# EAGLE design Plato_soldadura_328P (EAGLE 6.5.0)
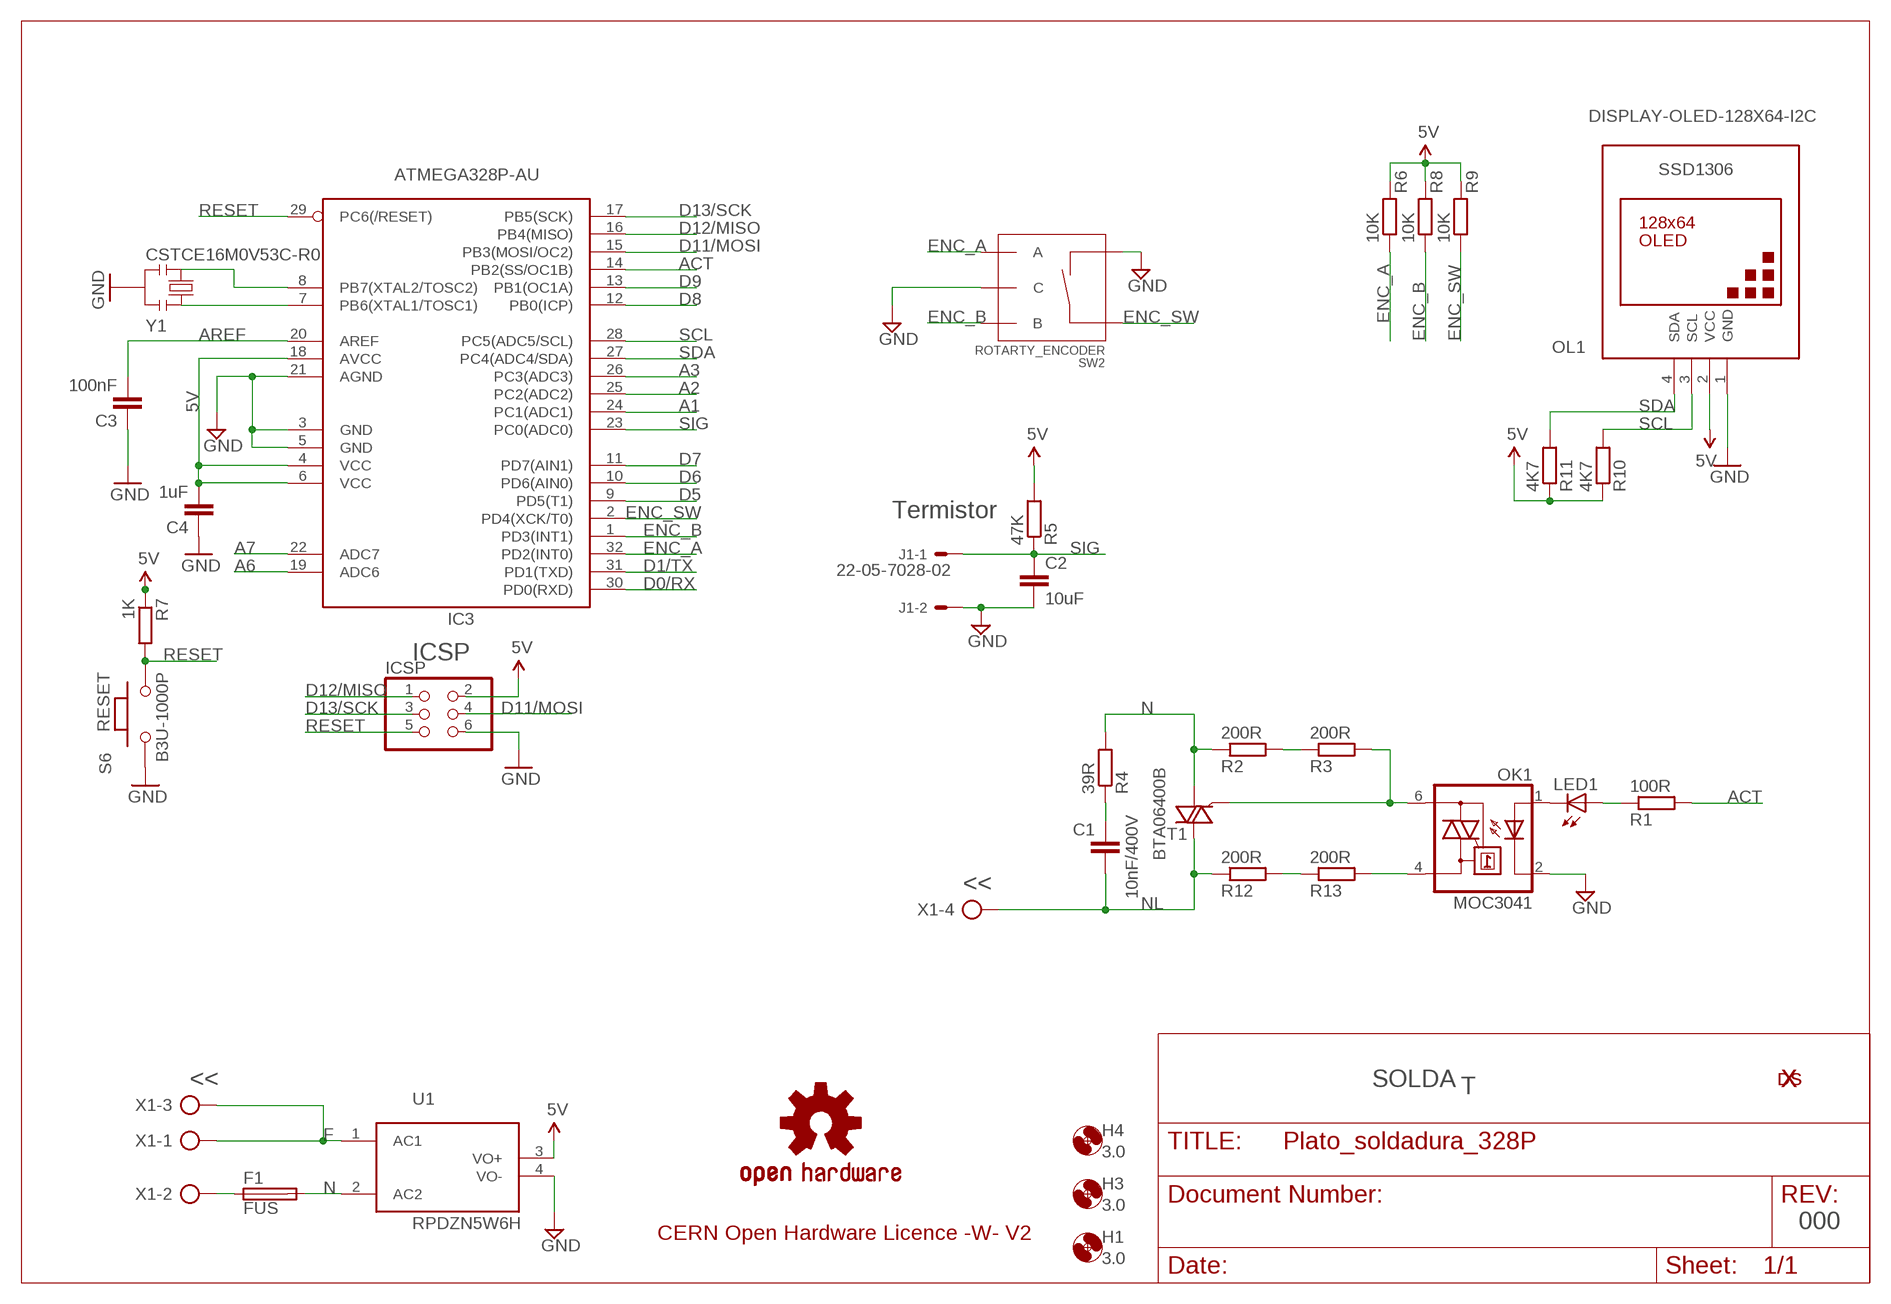
[diagram p0: schematic, sheet 1]

## Parts
C1  10nF/400V  C-EU075-042X103  [C075-042X103]
C2  10uF  C-EUC1206  [C1206]
C3  100nF  C-EUC0603  [C0603]
C4  1uF  C-EUC0603  [C0603]
F1  FUS  FUSETE5  [TE5]
H1  3.0  MOUNT-HOLE3.0  [3,0]
H3  3.0  MOUNT-HOLE3.0  [3,0]
H4  3.0  MOUNT-HOLE3.0  [3,0]
IC3  ATMEGA328P-AU  0265_ATMEGA328P-AU  [TQFP32-08]
ICSP  0114_PH254-203DF118A00V  [2X03]
J1  22-05-7028-02  [7395-02]
LED1  LEDCHIP-LED0603  [CHIP-LED0603]
LOGO2  OSHW-LOGOL  [ESCORNA_LBRESCORNA_CPU_2_10_SPARKFUN-AESTHETICS_OSHW-LOGO-L]
OK1  MOC3041  IL410  [DIL06]
OL1  DISPLAY-OLED-128X64-I2C  [DISPLAY-OLED-128X64-I2C]
R1  100R  R-EU_R0603  [R0603]
R2  200R  R-EU_R1206  [R1206]
R3  200R  R-EU_R1206  [R1206]
R4  39R  R-EU_0204/7  [0204/7]
R5  47K  R-EU_R0603  [R0603]
R6  10K  R-EU_R0603  [R0603]
R7  1K  R-EU_R0603  [R0603]
R8  10K  R-EU_R0603  [R0603]
R9  10K  R-EU_R0603  [R0603]
R10  4K7  R-EU_R0603  [R0603]
R11  4K7  R-EU_R0603  [R0603]
R12  200R  R-EU_R1206  [R1206]
R13  200R  R-EU_R1206  [R1206]
S6  B3U-1000P  0173_IT-1185AP1C-160G-G_T&R  [SMD_157SW]
SW2  ROTARTY_ENCODER  [ROTARY_ENC_PLAIN]
T1  BTA06400B  BT136  [TO220AB]
U1  RPDZN5W6H  [RPDZN5W6H]
U$7  XDESIG_XDESIG5MM  [XDESIG_XDESIG_CU]
U$8  XDESIG_XDESIG21  [XDESIG_XDESIG]
X1  AK500/4-H  [AK500/4-H]
Y1  CSTCE16M0V53C-R0  0011_CSTCE16M0V53-R0  [RESONATOR]

## Nets
5V: C4.2 IC3.4(VCC) IC3.6(VCC) IC3.18(AVCC) ICSP.2 OL1.2(VCC) R5.2 R6.2 R7.1 R8.2 R9.2 R10.1 R11.1 U1.3(VO+)
A1: IC3.24(PC1(ADC1))
A2: IC3.25(PC2(ADC2))
A3: IC3.26(PC3(ADC3))
A6: IC3.19(ADC6)
A7: IC3.22(ADC7)
ACT: IC3.14(PB2(SS/OC1B)) R1.2
AREF [aref]: C3.2 IC3.20(AREF)
D0/RX: IC3.30(PD0(RXD))
D1/TX: IC3.31(PD1(TXD))
D5: IC3.9(PD5(T1))
D6: IC3.10(PD6(AIN0))
D7: IC3.11(PD7(AIN1))
D8: IC3.12(PB0(ICP))
D9: IC3.13(PB1(OC1A))
D11/MOSI: IC3.15(PB3(MOSI/OC2)) ICSP.4
D12/MISO: IC3.16(PB4(MISO)) ICSP.1
D13/SCK: IC3.17(PB5(SCK)) ICSP.3
ENC_A: IC3.32(PD2(INT0)) R6.1 SW2.A
ENC_B: IC3.1(PD3(INT1)) R8.1 SW2.B
ENC_SW: IC3.2(PD4(XCK/T0)) R9.1 SW2.SW+
F: U1.1(AC1) X1.1 X1.3
GND: C2.2 C3.1 C4.1 IC3.3(GND) IC3.5(GND) IC3.21(AGND) ICSP.6 J1.2 OK1.2(C) OL1.1(GND) S6.1 SW2.C SW2.SW- U1.4(VO-) Y1.2
N: F1.2 R2.1 R4.2 T1.1(A1) U1.2(AC2)
N$1: OK1.4(A1) R13.2
N$2: F1.1 X1.2
N$3: OK1.6(A2) R3.2 T1.3(G)
N$4: LED1.C OK1.1(A)
N$5: LED1.A R1.1
N$6: R2.2 R3.1
N$7: R12.2 R13.1
N$11: C1.1 R4.1
N$17: IC3.7(PB6(XTAL1/TOSC1)) Y1.1
N$18: IC3.8(PB7(XTAL2/TOSC2)) Y1.3
NL: C1.2 R12.1 T1.2(A2) X1.4
RESET: IC3.29(PC6(/RESET)) ICSP.5 R7.2 S6.2
SCL: IC3.28(PC5(ADC5/SCL)) OL1.3(SCL) R10.2
SDA: IC3.27(PC4(ADC4/SDA)) OL1.4(SDA) R11.2
SIG: C2.1 IC3.23(PC0(ADC0)) J1.1 R5.1

## Notes on the sheet
- SSD1306
- Termistor
- ICSP
- RESET
- <<
- << | SOLDA
- T
- 000
- CERN Open Hardware Licence -W- V2

## Library data of the parts
C1-C4 = rcl:C-EU: CAPACITOR, European symbol
F1 = fuse:FUSE: Fuse; OC_FARNELL: unknown; OC_NEWARK: unknown
H1 H3 H4 = holes:MOUNT-HOLE: MOUNTING HOLE with drill center marker
IC3 = IntegratedCircuits:0265_ATMEGA328P-AU: 8-bit Microcontroller with 32KBytes In-System Programmable Flash ATMEGA328P-AU; CASE: TQFP32_7x7; MONTHLY_USAGE: _____; PART_NUMBER: ATMEGA328P-AU; PRICE: _____; SUPPLIER: _____; TYPE: Circuito_Integrato
ICSP = Connettori:0114_PH254-203DF118A00V: 3x2 M V h 8,5 mm p2,54; MONTHLY_USAGE: _____; PART_NUMBER: PH254-203DF118A00V; PRICE: _____; SUPPLIER: _____; TYPE: Connettori; VALUE: ICSP
J1 = con-molex:22-?-02: CONNECTOR wire to board 2.54 mm (.1 inch) pitch header; OC_FARNELL: 9731601; OC_NEWARK: unknown
LED1 = led:LED: LED OSRAM: - CHIPLED LG R971, LG N971, LY N971, LG Q971, LY Q971, LO R971, LY R971 LH N974, LH R974 LS Q976, LO Q976, LY Q976 LO Q996 - Hyper CHIPLED LW Q18S LB Q993, LB Q99A, LB R99A - SideLED LS A670, LO A670, LY A670, LG A670, LP A670 LB A673, LV A673, LT A673, LW A673 LH A674 LY A675 LS A676, LA A676, LO A676, LY A676, LW A676 LS A679, LY A679, LG A679 - Hyper Micro SIDELED® LS Y876, LA Y876, LO Y876, LY Y876 LT Y87S - SmartLED LW L88C, LW L88S LB L89C, LB L89S, LG L890 LS L89K, LO L89K, LY L89K LS L896, LA L896, LO L896, LY L896 - TOPLED LS T670, LO T670, LY T670, LG T670, LP T670 LSG T670, LSP T670, LSY T670, LOP T670, LYG T670 LG T671, LOG T671, LSG T671 LB T673, LV T673, LT T673, LW T673 LH T674 LS T676, LA T676, LO T676, LY T676, LB T676, LH T676, LSB T676, LW T676 LB T67C, LV T67C, LT T67C, LS T67K, LO T67K, LY T67K, LW E67C LS E67B, LA E67B, LO E67B, LY E67B, LB E67C, LV E67C, LT E67C LW T67C LS T679, LY T679, LG T679 LS T770, LO T770, LY T770, LG T770, LP T770 LB T773, LV T773, LT T773, LW T773 LH T774 LS E675, LA E675, LY E675, LS T675 LS T776, LA T776, LO T776, LY T776, LB T776 LHGB T686 LT T68C, LB T68C - Hyper Mini TOPLED® LB M676 - Mini TOPLED Santana® LG M470 LS M47K, LO M47K, LY M47K Source: http://www.osram.convergy.de LUXEON: - LUMILED® LXK2-PW12-R00, LXK2-PW12-S00, LXK2-PW14-U00, LXK2-PW14-V00 LXK2-PM12-R00, LXK2-PM12-S00, LXK2-PM14-U00 LXK2-PE12-Q00, LXK2-PE12-R00, LXK2-PE12-S00, LXK2-PE14-T00, LXK2-PE14-U00 LXK2-PB12-K00, LXK2-PB12-L00, LXK2-PB12-M00, LXK2-PB14-N00, LXK2-PB14-P00, LXK2-PB14-Q00 LXK2-PR12-L00, LXK2-PR12-M00, LXK2-PR14-Q00, LXK2-PR14-R00 LXK2-PD12-Q00, LXK2-PD12-R00, LXK2-PD12-S00 LXK2-PH12-R00, LXK2-PH12-S00 LXK2-PL12-P00, LXK2-PL12-Q00, LXK2-PL12-R00 Source: www.luxeon.com KINGBRIGHT: KA-3528ASYC Source: www.kingbright.com
LOGO2 = Echidna_shield_LBR:OSHW-LOGO: Open Source Hardware Logo This logo indicates the piece of hardware it is found on incorporates a OSHW license and/or adheres to the definition of open source hardware found here: http://freedomdefined.org/OSHW
OK1 = optocoupler:IL410: SIEMENS OPTO COUPLER; MF: VISHAY/TELEFUNKEN; MPN: IL410; OC_FARNELL: 1045434; OC_NEWARK: 58K1715
OL1 = diy-modules:DISPLAY-OLED-128X64-I2C: 128x64 Dot Matrix OLED Module based on SSD1306 chip Variant with I2C interface More details available here: http://www.instructables.com/id/Monochrome-096-i2c-OLED-display-with-arduino-SSD13/ SSD1306 datasheet: https://cdn-shop.adafruit.com/datasheets/SSD1306.pdf Click here to find device on ebay.com <http://www.ebay.com/sch/oled+display+128x64+iic> Note: There are two variants: I2C and SPI. Search for the proper version.
R1-R13 = rcl:R-EU_: RESISTOR, European symbol
S6 = Switches:0173_IT-1185AP1C-160G-G_T&R: Pushbutton 4x3 SMD H2,5mm; MONTHLY_USAGE: _____; PART_NUMBER: IT-1185AP1C-160G-G_T&R; PRICE: _____; SUPPLIER: _____; TYPE: Switches; VALUE: 157SW
SW2 = SparkFun-Electromechanical:ROTARTY_ENCODER: Simple no LED rotary encoder Example: COM-09117
T1 = triac:BT136: Triac BT136 series E sensitive gate Source: http://www.nxp.com/acrobat_download/datasheets/BT136_SERIES_E_2.pdf
U1 = RPDZN:RPDZN5W6
U$7 U$8 = cervus2.100:XDESIG_XDESIG
X1 = con-ptr500:AK500/4-H: CONNECTOR Aug. 2004 / PTR Meßtechnik: Die Bezeichnung der Serie AK505 wurde geändert. Es handelt sich hierbei um AK500 in horizontaler Ausführung.; OC_FARNELL: unknown; OC_NEWARK: unknown
Y1 = Cristalli:0011_CSTCE16M0V53-R0: 16Mhz - SMD; MONTHLY_USAGE: _____; PART_NUMBER: CSTCE16M0V53-R0; PRICE: _____; SUPPLIER: _____; TYPE: Cristalli; VALUE: CSTCE16M0V53-R0

## Net classes
4 aref: width 0.254 mm, drill 0.61 mm, clearance 0.254 mm

## Board
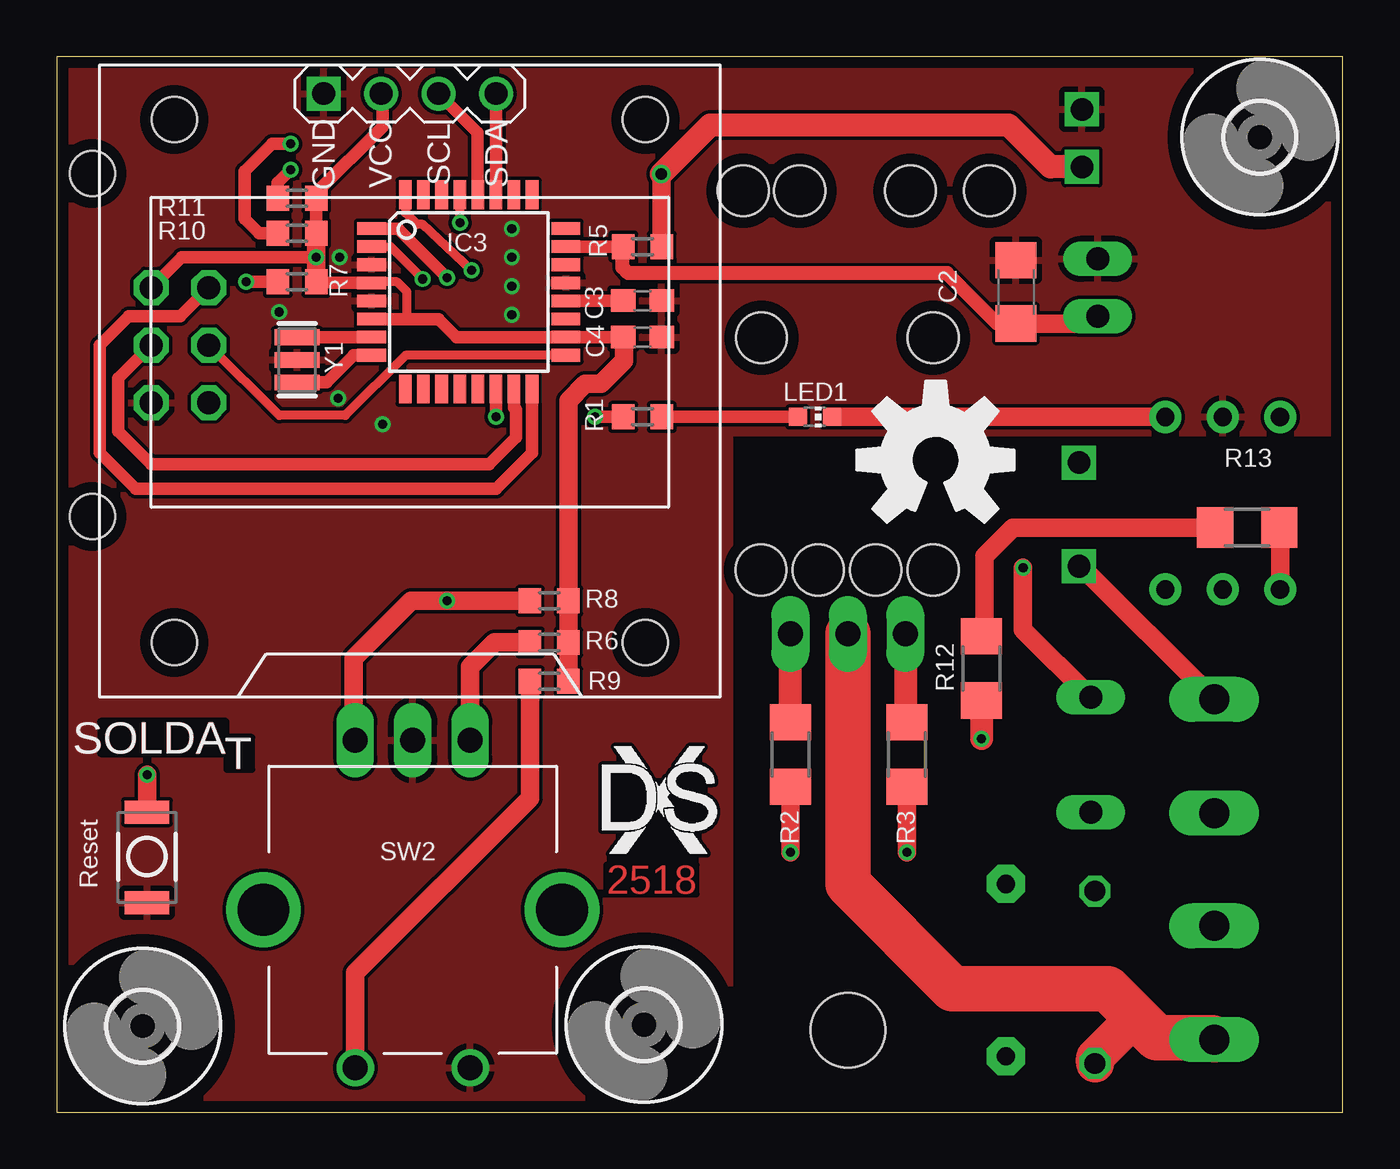
[diagram p1: board, top side]
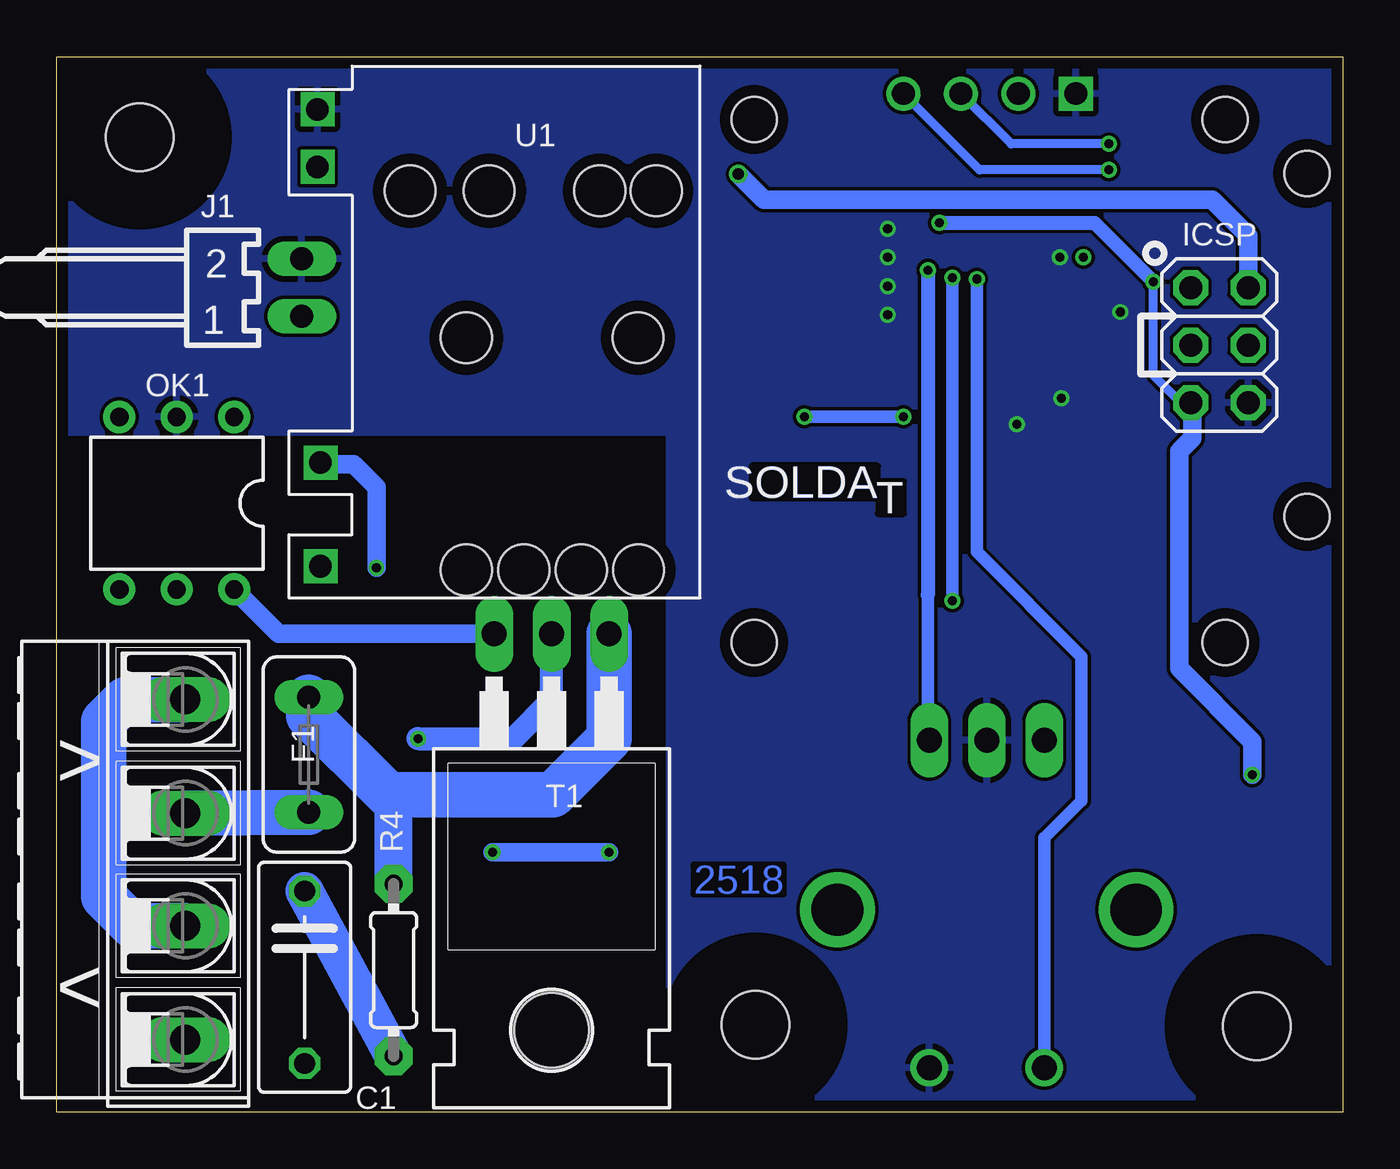
[diagram p2: board, bottom side, seen from below]

Size 56.88 x 46.66 mm. Coordinates in mm from the lower left corner, seen from the top.
Outline: 0,0 56.88,0 56.88,46.66 0,46.66 0,0
Copper layers (1*16): Top 0.035mm / dielectric 1.6mm / Bottom 0.035mm
Design rules "Elecrow_2-layer_PCB_eagle_rule": minimum track width 6mil, minimum drill 12mil, track to track 6mil, track to pad 8mil, pad to pad 12mil, via to via 12mil, smd to smd 0mil, copper to edge 20mil, drill to drill 10mil, minimum pad ring 6mil, minimum via ring 6mil, stop-mask expansion 0mil, vias tented up to drill 100mil, thermal gap 10mil
Holes 2 mm at 1.58,26.33 1.58,41.49

### Footprints (pad centres in the part's own frame; a part is rotated, then mirrored left to right if it is on the bottom)
C075-042X103 = drill 0.914 octagon: 1 -3.81,0; 2 3.81,0
C1206 = smd 1.6 x 1.8: 1 -1.4,0; 2 1.4,0
C0603 = smd 1.1 x 1: 1 -0.85,0; 2 0.85,0
TE5 = drill 1.016 long: 1 -2.54,0; 2 2.54,0
3,0 = hole 3: 0,0
TQFP32-08 = smd 1.27 x 0.559: 1 -4.293,2.8; 2 -4.293,2; 3 -4.293,1.2; 4 -4.293,0.4; 5 -4.293,-0.4; 6 -4.293,-1.2; 7 -4.293,-2; 8 -4.293,-2.8; 17 4.293,-2.8; 18 4.293,-2; 19 4.293,-1.2; 20 4.293,-0.4; 21 4.293,0.4; 22 4.293,1.2; 23 4.293,2; 24 4.293,2.8 | smd 0.559 x 1.27: 9 -2.8,-4.293; 10 -2,-4.293; 11 -1.2,-4.293; 12 -0.4,-4.293; 13 0.4,-4.293; 14 1.2,-4.293; 15 2,-4.293; 16 2.8,-4.293; 25 2.8,4.293; 26 2,4.293; 27 1.2,4.293; 28 0.4,4.293; 29 -0.4,4.293; 30 -1.2,4.293; 31 -2,4.293; 32 -2.8,4.293
2X03 = drill 1.016 pad 1.55 octagon: 1 -2.54,-1.27; 2 -2.54,1.27; 3 0,-1.27; 4 0,1.27; 5 2.54,-1.27; 6 2.54,1.27
7395-02 = drill 1.016 long: 1 1.27,0; 2 -1.27,0
CHIP-LED0603 = smd 0.8 x 0.8: A 0,-0.75; C 0,0.75
DIL06 = drill 0.8 pad 1.422: 1 -2.54,-3.81 | drill 0.813 pad 1.422: 2 0,-3.81; 3 2.54,-3.81; 4 2.54,3.81; 5 0,3.81; 6 -2.54,3.81
DISPLAY-OLED-128X64-I2C = drill 1 square: 1 -3.81,12.7 | drill 1: 2 -1.27,12.7; 3 1.27,12.7; 4 3.81,12.7 | hole 2: -10.414,11.557; 10.414,11.557; 10.414,-11.557; -10.414,-11.557
R0603 = smd 1 x 1.1: 1 -0.85,0; 2 0.85,0
R1206 = smd 1.6 x 1.803: 1 -1.422,0; 2 1.422,0
0204/7 = drill 0.813 pad 1.676 octagon: 1 -3.81,0; 2 3.81,0
SMD_157SW = smd 1.016 x 1.981: 1 0,0; 2 4,0
ROTARY_ENC_PLAIN = drill 1.1 long: A 7.493,-2.54; B 7.493,2.54; C 7.493,0 | drill 2.286: P$3 0,6.604; P$4 0,-6.604 | drill 1.1: SW+ -6.985,2.54; SW- -6.985,-2.54
TO220AB = drill 1.118 long: 1 -2.54,-6.35; 2 0,-6.35; 3 2.54,-6.35 | hole 3.302: 0,11.176
RPDZN5W6H = drill 1 square: 1 22.095,1.4; 2 17.513,1.4; 3 4.445,1.27; 4 1.905,1.27 | hole 2.25: 5.5,8.85; 5.5,5.36; 5.5,13.75; 5.5,16.25; 12,7.85; 12,15.44; 22.26,7.85; 22.26,10.39; 22.26,12.93; 22.26,15.47
AK500/4-H = drill 1.321 long: 1 -7.518,0; 2 -2.489,0; 3 2.489,0; 4 7.518,0
RESONATOR = smd 0.7 x 2: 1 -1,0; 2 0,0; 3 1,0

### Placement (x,y rotation side)
C1  45.91,5.97 270 bottom
C2  42.42,36.26 90 top
C3  25.91,35.88 180 top
C4  25.91,34.26 180 top
F1  45.72,15.81 90 bottom
H1  25.97,3.87 0 top
H3  3.81,3.81 0 top
H4  53.2,43.1 0 top
IC3  18.22,36.26 0 top
ICSP  5.46,33.91 270 bottom
J1  46.04,36.45 270 bottom
LED1  33.53,30.73 270 top
LOGO2  38.86,28.83 0 top
OK1  51.56,26.92 180 bottom
OL1  15.62,32.32 0 top
R1  25.91,30.73 180 top
R2  32.45,15.81 270 top
R3  37.59,15.81 90 top
R4  41.97,6.29 90 bottom
R5  25.91,38.26 0 top
R6  21.78,20.76 0 top
R7  10.63,36.7 180 top
R8  21.78,22.61 0 top
R9  21.78,19.05 0 top
R10  10.63,38.85 180 top
R11  10.63,40.4 180 top
R12  40.89,19.62 90 top
R13  52.64,25.84 0 top
S6  4,9.27 90 top
SW2  15.75,8.95 90 top
T1  34.99,14.8 180 bottom
U1  46.61,46.23 270 bottom
U$7  24.13,11.43 0 top
U$8  24.13,11.43 0 top
X1  51.18,10.73 270 bottom
Y1  10.63,33.25 270 top

### Tracks (layer width: path | path; a pad name or v marks a point on that pad's centre or on a via)
5V  (via drill 0.4, 0.5)
  Top 0.406: IC3.4 13.93,36.7 15.05,36.7 15.49,36.26 15.49,35.12 15.56,35.06 | R11.1 11.48,40.63 | 14.41,44.96 OL1.2 | 11.42,37.66 11.48,37.59
  Top 0.55: IC3.4 12.22,36.66 R7.1 | C4.2 IC3.18 17.68,34.26 16.88,35.06 15.56,35.06 IC3.6 | 11.48,37.59 v11.48,37.78 | R10.1 R11.1 | 11.48,40.63 14.41,43.56 14.41,44.96 | 11.42,37.66 11.42,37.77 11.43,37.78 5.52,37.78 ICSP.2
  Top 0.813: v11.48,37.78 R10.1 | 11.48,37.59 R7.1 | R5.2 26.76,41.44 v26.73,41.47 | R9.2 R6.2 R8.2 22.63,31.46 23.37,32.19 24.07,32.19 25.08,33.21 25.08,34.23 C4.2
  Top 1.016: U1.3 43.94,41.78 42.1,43.62 28.89,43.62 v26.73,41.47
  Bottom 0.813: v26.73,41.47 25.59,40.32 5.78,40.32 4.19,38.73 ICSP.2
ACT  (via drill 0.4)
  Top 0.55: IC3.14 v19.42,30.74 v19.43,30.73 | v23.81,30.73 R1.2
  Bottom 0.55: v19.43,30.73 v23.81,30.73
AREF
  Top 0.406: 22.54,35.88 IC3.20
  Top 0.55: C3.2 22.54,35.88
D11/MOSI
  Top 0.55: IC3.15 20.22,31.15 20.32,31.05 20.32,29.84 19.11,28.64 4.19,28.64 2.73,30.1 2.73,32.45 ICSP.4
D12/MISO
  Top 0.55: IC3.16 21.02,29.15 19.43,27.56 3.49,27.56 1.91,29.15 1.91,33.89 3.19,35.18 5.46,35.18 ICSP.1
D13/SCK
  Top 0.406: IC3.17 15.43,33.46 12.76,30.8 9.84,30.8 ICSP.3
ENC_A  (via drill 0.4)
  Top 0.406: IC3.32 15.43,39.76 15.94,39.24 16.19,39.24 v18.35,37.21
  Top 0.813: SW2.A 18.29,19.68 19.37,20.77 R6.1
  Bottom 0.55: 18.35,22.86 18.35,16.51 SW2.A
  Bottom 0.61: v18.35,37.21 18.35,22.86
ENC_B  (via drill 0.4)
  Top 0.55: IC3.1 15.11,39.06 v17.27,36.89
  Top 0.813: R8.1 v17.27,22.61 16.51,22.61 15.68,22.61 13.14,20.07 13.14,16.51 SW2.B
  Bottom 0.55: v17.27,36.89 v17.27,22.61
ENC_SW  (via drill 0.4)
  Top 0.406: IC3.2 14.76,38.26 v16.19,36.83
  Top 0.813: SW2.SW+ 13.21,6.16 20.93,13.88 R9.1
  Bottom 0.55: v16.19,36.83 16.19,24.77 11.56,20.13 11.56,13.78 13.21,12.13 SW2.SW+
F
  Top 0.813: U1.1 45.3,24.13 X1.1
  Bottom 1.676: 51.21,18.22 X1.1
  Bottom 2: X1.3 53.52,8.24 54.8,9.53 54.8,17.27 53.85,18.22 51.21,18.22
GND  (via drill 0.4)
  other vias: 12.51,37.78 9.84,35.37 14.41,30.42 12.45,31.56 20.13,39.05 20.13,37.78 20.13,36.51 20.13,35.24
  pour Top: 0,0 29.78,0 29.78,30.04 57.15,30.04 57.15,31.75 57.15,46.99 0,46.99
  pour Bottom: 0,0 29.78,0 29.78,30.04 57.15,30.04 57.15,46.99 0,46.99
N  (via drill 0.4)
  Top 0.813: v42.74,24.07 42.74,21.34 F1.2
  Top 1.016: R2.1 T1.1
  Bottom 0.813: v42.74,24.07 42.74,27.62 43.75,28.64 45.13,28.64 U1.2
  Bottom 1.676: 42.23,14.03 41.97,14.03 R4.2
  Bottom 2: T1.1 32.45,16.51 34.92,14.03 41.97,14.03 | 42.23,14.03 45.72,17.53 F1.2
N$1
  Top 0.813: OK1.4 54.1,25.69 R13.2
N$2
  Bottom 2: F1.1 X1.2
N$3
  Top 1.016: T1.3 37.53,17.3 R3.2
  Bottom 0.813: T1.3 47.06,21.14 OK1.6
N$4
  Top 0.813: LED1.C OK1.1
N$5
  Top 0.55: R1.1 LED1.A
N$6  (via drill 0.4)
  Top 0.813: R2.2 v32.45,11.5 | v37.59,11.5 R3.1
  Bottom 0.813: v32.45,11.5 v37.59,11.5
N$7
  Top 0.813: R12.2 41.02,21.17 41.02,24.57 42.29,25.84 R13.1
N$11
  Bottom 1.676: C1.1 R4.1
N$17
  Top 0.406: 11.37,34.26 Y1.1
  Top 0.55: IC3.7 11.37,34.26
N$18
  Top 0.406: Y1.3
  Top 0.55: IC3.8 13.14,33.46 11.94,32.26 Y1.3
NL  (via drill 0.4)
  Top 1.016: R12.1 v40.89,16.51
  Top 1.676: C1.2 45.91,2.41 47.72,4.22
  Top 2: T1.2 34.99,10.09 39.62,5.46 46.48,5.46 47.72,4.22 48.64,3.3 51.09,3.3 X1.4
  Bottom 1.016: v40.89,16.51 36.7,16.52 34.99,18.23 T1.2
RESET  (via drill 0.4)
  Top 0.406: IC3.29 17.82,39.92 v17.84,39.31
  Top 0.55: v8.38,36.7 R7.2
  Top 0.813: S6.2 v4,14.92
  Bottom 0.406: ICSP.5 7.18,31.37 8.38,32.58 v8.38,36.7
  Bottom 0.61: v17.84,39.31 10.99,39.31 v8.38,36.7
  Bottom 0.813: v4,14.92 4,16.38 7.24,19.62 7.24,29.21 6.67,29.78 6.67,31.3 ICSP.5
SCL  (via drill 0.4)
  Top 0.55: IC3.28 18.62,43.29 OL1.3 | v10.35,42.8 9.53,42.8 8.32,41.59 8.32,39.5 8.97,38.85 R10.2
  Bottom 0.406: v10.35,42.8 14.67,42.8 OL1.3
SDA  (via drill 0.4)
  Top 0.55: IC3.27 19.42,43.74 OL1.4 | R11.2 9.78,41.09 v10.35,41.66
  Bottom 0.406: v10.35,41.66 16.07,41.66 OL1.4
SIG
  Top 0.55: R5.1 IC3.23
  Top 0.61: C2.1 41.6,34.86 39.37,37.08 25.27,37.08 25.02,37.34 25.02,38.22 R5.1
  Top 0.813: C2.1 46.1,34.86 J1.1

### Text on the board
Top: SOLDA | T | 2518
Bottom: SOLDA | T | 2518
tPlace: SOLDA | T | Reset
bPlace: SOLDA | T | > | <